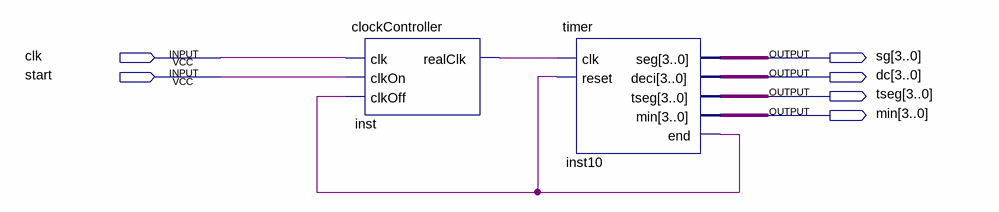
[diagram p0: schematic sheet]
// Quartus schematic projetoFinalLCL.bdf as structural Verilog: 2 symbols, 6 pins
module projetoFinalLCL (
  input  clk,
  input  start,
  output [3:0] sg,
  output [3:0] dc,
  output [3:0] tseg,
  output [3:0] min
);

  wire inst10_end, inst_realclk;

  clockController inst (.clk(clk), .clkOn(start), .clkOff(inst10_end), .realClk(inst_realclk));
  timer inst10 (
    .clk(inst_realclk), .reset(inst10_end), .seg(sg), .deci(dc), .tseg(tseg), .min(min), .\end (inst10_end));
endmodule
